# Altium schematic sheet Hardware_Architecture.SchDoc: Dahlia Carrier Board
size A3; Organization: Toradex AG; Address1: Ebenaustrasse 10; Address2: Horw; Address3: 6048; Address4: Switzerland; DocumentNumber: 1; Revision: V1.1; SheetNumber: 1; SheetTotal: 21; PageSetup: Record=PageOptions|CenterHorizontal=True|CenterVertical=True|PrintScale=0.73|XCorrection=1.00|YCorrection=1.00|PrintKind=0|BorderSize=5000000|LeftOffset=0|BottomOffset=0|Orientation=2|PaperLength=1000|PaperWidth=1000|Scale=100|PaperSource=7|PrintQuality=600|MediaType=1|DitherType=10|PaperKind=A4|PrintScaleMode=1
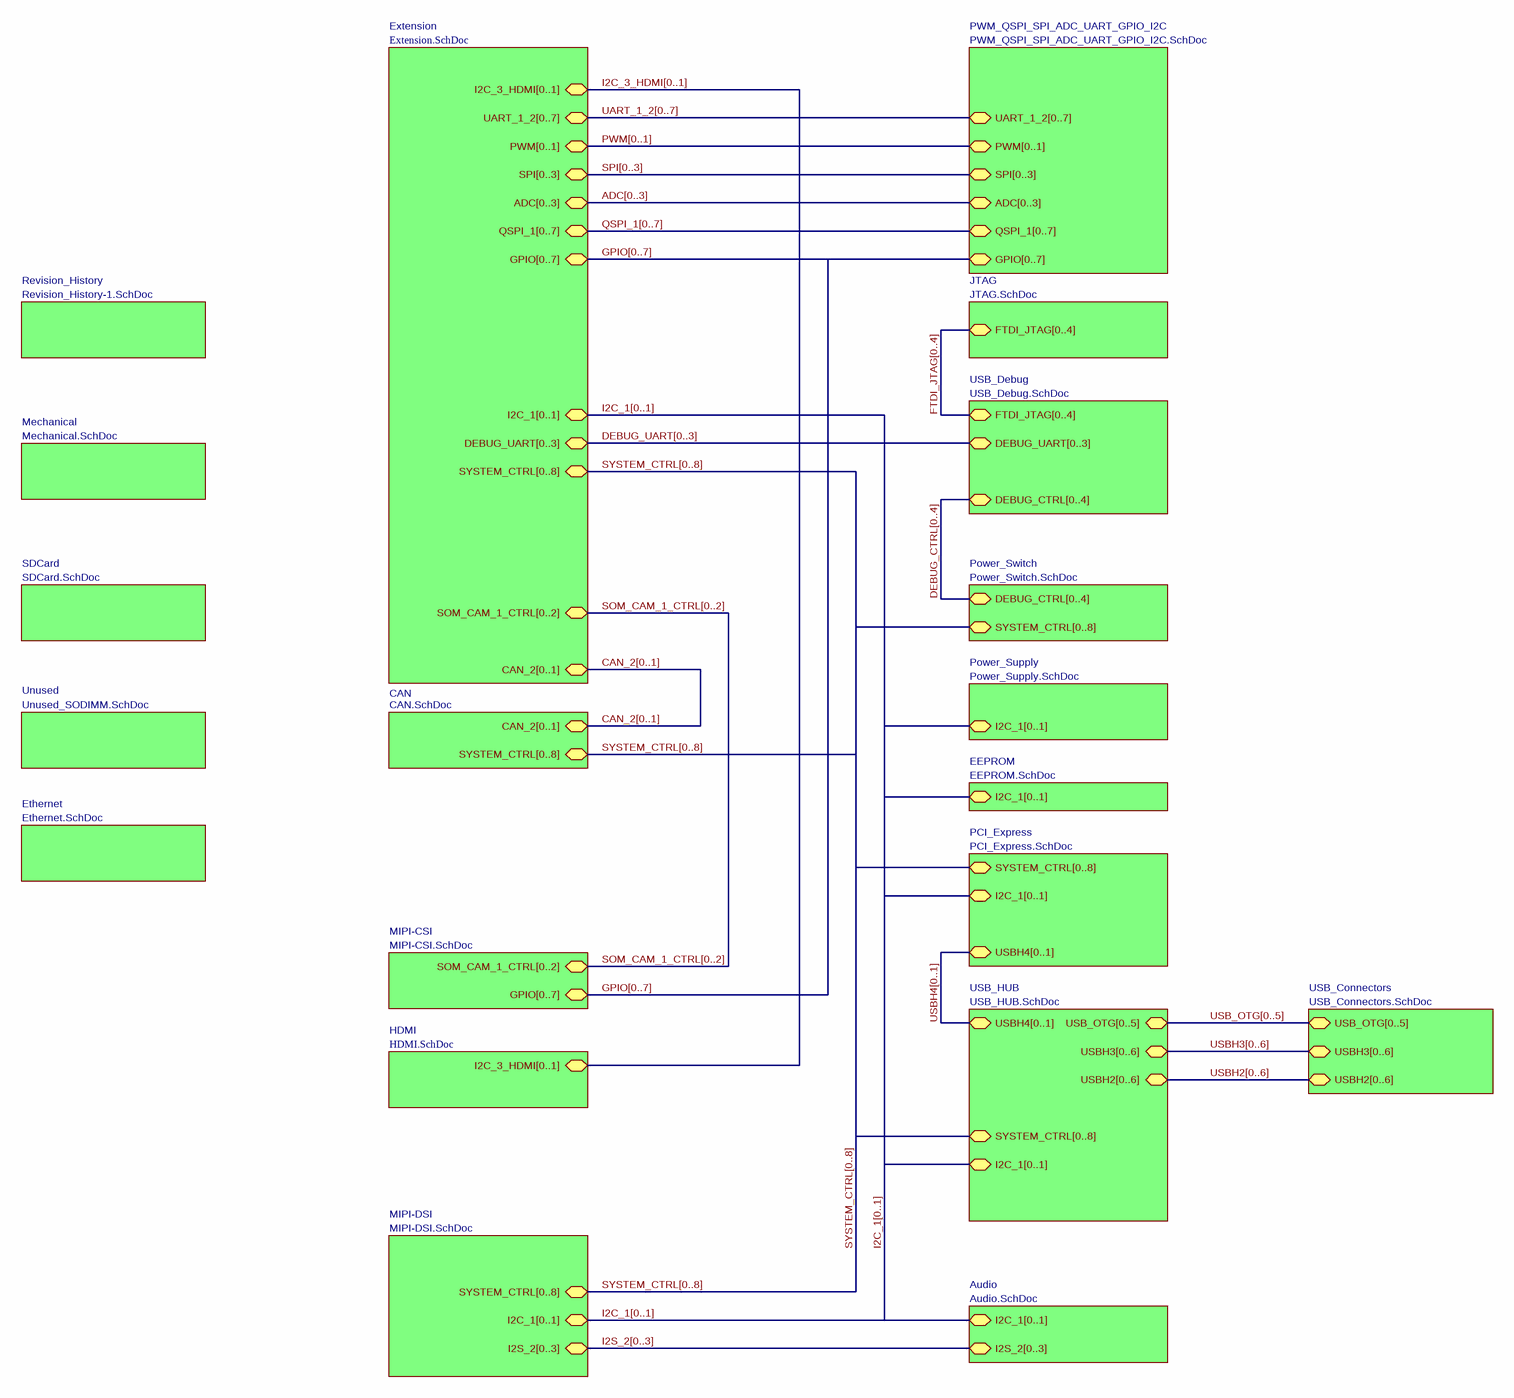
[diagram p0: Hardware_Architecture.SchDoc]

## Sub-sheets
Audio = Audio.SchDoc: I2C_1[0..1] (bidir), I2S_2[0..3] (bidir)
CAN = CAN.SchDoc: CAN_2[0..1] (bidir), SYSTEM_CTRL[0..8] (bidir)
EEPROM = EEPROM.SchDoc: I2C_1[0..1] (bidir)
Ethernet = Ethernet.SchDoc: no entries
Extension = Extension.SchDoc: ADC[0..3] (bidir), PWM[0..1] (bidir), SYSTEM_CTRL[0..8] (bidir), SPI[0..3] (bidir), DEBUG_UART[0..3] (bidir), CAN_2[0..1] (bidir), SOM_CAM_1_CTRL[0..2] (bidir), QSPI_1[0..7] (bidir), I2C_1[0..1] (bidir), UART_1_2[0..7] (bidir), I2C_3_HDMI[0..1] (bidir), GPIO[0..7] (bidir)
HDMI = HDMI.SchDoc: I2C_3_HDMI[0..1] (bidir)
JTAG = JTAG.SchDoc: FTDI_JTAG[0..4] (bidir)
Mechanical = Mechanical.SchDoc: no entries
MIPI-CSI = MIPI-CSI.SchDoc: GPIO[0..7] (bidir), SOM_CAM_1_CTRL[0..2] (bidir)
MIPI-DSI = MIPI-DSI.SchDoc: I2S_2[0..3] (bidir), SYSTEM_CTRL[0..8] (bidir), I2C_1[0..1] (bidir)
PCI_Express = PCI_Express.SchDoc: USBH4[0..1] (bidir), SYSTEM_CTRL[0..8] (bidir), I2C_1[0..1] (bidir)
Power_Supply = Power_Supply.SchDoc: I2C_1[0..1] (bidir)
Power_Switch = Power_Switch.SchDoc: DEBUG_CTRL[0..4] (bidir), SYSTEM_CTRL[0..8] (bidir)
PWM_QSPI_SPI_ADC_UART_GPIO_I2C = PWM_QSPI_SPI_ADC_UART_GPIO_I2C.SchDoc: PWM[0..1] (bidir), SPI[0..3] (bidir), ADC[0..3] (bidir), QSPI_1[0..7] (bidir), UART_1_2[0..7] (bidir), GPIO[0..7] (bidir)
Revision_History = Revision_History-1.SchDoc: no entries
SDCard = SDCard.SchDoc: no entries
Unused = Unused_SODIMM.SchDoc: no entries
USB_Connectors = USB_Connectors.SchDoc: USB_OTG[0..5] (bidir), USBH2[0..6] (bidir), USBH3[0..6] (bidir)
USB_Debug = USB_Debug.SchDoc: DEBUG_CTRL[0..4] (bidir), FTDI_JTAG[0..4] (bidir), DEBUG_UART[0..3] (bidir)
USB_HUB = USB_HUB.SchDoc: USB_OTG[0..5] (bidir), SYSTEM_CTRL[0..8] (bidir), I2C_1[0..1] (bidir), USBH2[0..6] (bidir), USBH4[0..1] (bidir), USBH3[0..6] (bidir)

## Buses and harness runs
bus ADC[0..3] = sheet Extension/ADC[0..3] = sheet PWM_QSPI_SPI_ADC_UART_GPIO_I2C/ADC[0..3]
bus CAN_2[0..1] = sheet CAN/CAN_2[0..1] = sheet Extension/CAN_2[0..1]
bus DEBUG_CTRL[0..4] = sheet Power_Switch/DEBUG_CTRL[0..4] = sheet USB_Debug/DEBUG_CTRL[0..4]
bus DEBUG_UART[0..3] = sheet Extension/DEBUG_UART[0..3] = sheet USB_Debug/DEBUG_UART[0..3]
bus FTDI_JTAG[0..4] = sheet JTAG/FTDI_JTAG[0..4] = sheet USB_Debug/FTDI_JTAG[0..4]
bus GPIO[0..7] = sheet Extension/GPIO[0..7] = sheet MIPI-CSI/GPIO[0..7] = sheet PWM_QSPI_SPI_ADC_UART_GPIO_I2C/GPIO[0..7]
bus I2C_1[0..1] = sheet Audio/I2C_1[0..1] = sheet EEPROM/I2C_1[0..1] = sheet Extension/I2C_1[0..1] = sheet MIPI-DSI/I2C_1[0..1] = sheet PCI_Express/I2C_1[0..1] = sheet Power_Supply/I2C_1[0..1] = sheet USB_HUB/I2C_1[0..1]
bus I2C_3_HDMI[0..1] = sheet Extension/I2C_3_HDMI[0..1] = sheet HDMI/I2C_3_HDMI[0..1]
bus I2S_2[0..3] = sheet Audio/I2S_2[0..3] = sheet MIPI-DSI/I2S_2[0..3]
bus PWM[0..1] = sheet Extension/PWM[0..1] = sheet PWM_QSPI_SPI_ADC_UART_GPIO_I2C/PWM[0..1]
bus QSPI_1[0..7] = sheet Extension/QSPI_1[0..7] = sheet PWM_QSPI_SPI_ADC_UART_GPIO_I2C/QSPI_1[0..7]
bus SOM_CAM_1_CTRL[0..2] = sheet Extension/SOM_CAM_1_CTRL[0..2] = sheet MIPI-CSI/SOM_CAM_1_CTRL[0..2]
bus SPI[0..3] = sheet Extension/SPI[0..3] = sheet PWM_QSPI_SPI_ADC_UART_GPIO_I2C/SPI[0..3]
bus SYSTEM_CTRL[0..8] = sheet CAN/SYSTEM_CTRL[0..8] = sheet Extension/SYSTEM_CTRL[0..8] = sheet MIPI-DSI/SYSTEM_CTRL[0..8] = sheet PCI_Express/SYSTEM_CTRL[0..8] = sheet Power_Switch/SYSTEM_CTRL[0..8] = sheet USB_HUB/SYSTEM_CTRL[0..8]
bus UART_1_2[0..7] = sheet Extension/UART_1_2[0..7] = sheet PWM_QSPI_SPI_ADC_UART_GPIO_I2C/UART_1_2[0..7]
bus USB_OTG[0..5] = sheet USB_Connectors/USB_OTG[0..5] = sheet USB_HUB/USB_OTG[0..5]
bus USBH2[0..6] = sheet USB_Connectors/USBH2[0..6] = sheet USB_HUB/USBH2[0..6]
bus USBH3[0..6] = sheet USB_Connectors/USBH3[0..6] = sheet USB_HUB/USBH3[0..6]
bus USBH4[0..1] = sheet PCI_Express/USBH4[0..1] = sheet USB_HUB/USBH4[0..1]

## Notes on the sheet
- Title
- Size:
- Date:
- A3
- Number:
- Time:
- Revision:
- Sheet
- of
- File: